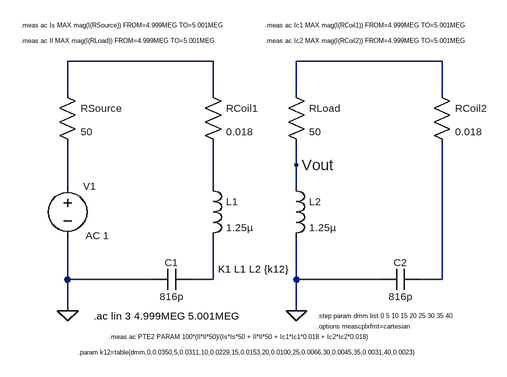
[diagram p0: schematic 2-coil_resonant_part-C.asc]
2-coil_resonant_part-C.asc, the LTspice schematic file:
Version 4.1
SHEET 1 880 680
WIRE 192 80 -32 80
WIRE 544 80 320 80
WIRE -32 128 -32 80
WIRE 192 128 192 80
WIRE 320 128 320 80
WIRE 544 128 544 80
WIRE 320 240 320 208
WIRE -32 272 -32 208
WIRE 192 272 192 208
WIRE 320 272 320 240
WIRE -32 416 -32 352
WIRE 96 416 -32 416
WIRE 192 416 192 352
WIRE 192 416 160 416
WIRE 320 416 320 352
WIRE 448 416 320 416
WIRE 544 416 544 208
WIRE 544 416 512 416
WIRE -32 464 -32 416
WIRE 320 464 320 416
FLAG -32 464 0
FLAG 320 464 0
FLAG 320 240 Vout
SYMBOL res -48 112 R0
WINDOW 0 36 40 Left 1
WINDOW 3 36 76 Left 1
SYMATTR InstName RSource
SYMATTR Value 50
SYMBOL res 304 112 R0
WINDOW 0 36 40 Left 1
WINDOW 3 36 76 Left 1
SYMATTR InstName RLoad
SYMATTR Value 50
SYMBOL ind 176 256 R0
WINDOW 0 36 40 Left 1
WINDOW 3 36 80 Left 1
SYMATTR InstName L1
SYMATTR Value 1.25µ
SYMATTR Type ind
SYMATTR SpiceLine Rser=1m
SYMBOL ind 304 256 R0
WINDOW 0 36 40 Left 1
WINDOW 3 36 80 Left 1
SYMATTR InstName L2
SYMATTR Value 1.25µ
SYMATTR Type ind
SYMATTR SpiceLine Rser=1m
SYMBOL voltage -32 256 R0
WINDOW 123 28 92 Left 1
WINDOW 39 0 0 Left 0
WINDOW 0 24 16 Left 1
SYMATTR Value2 AC 1
SYMATTR InstName V1
SYMATTR Value ""
SYMBOL cap 160 400 R90
WINDOW 0 0 32 VBottom 1
WINDOW 3 32 32 VTop 1
SYMATTR InstName C1
SYMATTR Value 816p
SYMBOL cap 512 400 R90
WINDOW 0 0 32 VBottom 1
WINDOW 3 32 32 VTop 1
SYMATTR InstName C2
SYMATTR Value 816p
SYMBOL res 176 112 R0
WINDOW 0 36 40 Left 1
WINDOW 3 36 76 Left 1
SYMATTR InstName RCoil1
SYMATTR Value 0.018
SYMBOL res 528 112 R0
WINDOW 0 36 40 Left 1
WINDOW 3 36 76 Left 1
SYMATTR InstName RCoil2
SYMATTR Value 0.018
TEXT 200 400 Left 1 !K1 L1 L2 {k12}
TEXT 352 472 Left 0 !.step param dmm list 0 5 10 15 20 25 30 35 40
TEXT -16 528 Left 0 !.param k12=table(dmm,0,0.0350,5,0.0311,10,0.0229,15,0.0153,20,0.0100,25,0.0066,30,0.0045,35,0.0031,40,0.0023)
TEXT -104 24 Left 0 !.meas ac Is MAX mag(I(RSource)) FROM=4.999MEG TO=5.001MEG
TEXT -104 48 Left 0 !.meas ac Il MAX mag(I(RLoad)) FROM=4.999MEG TO=5.001MEG
TEXT 272 24 Left 0 !.meas ac Ic1 MAX mag(I(RCoil1)) FROM=4.999MEG TO=5.001MEG
TEXT 272 48 Left 0 !.meas ac Ic2 MAX mag(I(RCoil2)) FROM=4.999MEG TO=5.001MEG
TEXT 32 504 Left 0 !.meas ac PTE2 PARAM 100*(Il*Il*50)/(Is*Is*50 + Il*Il*50 + Ic1*Ic1*0.018 + Ic2*Ic2*0.018)
TEXT 8 472 Left 1 !.ac lin 3 4.999MEG 5.001MEG
TEXT 352 488 Left 0 !.options meascplxfmt=cartesian

The netlist it stands for:
* 2-coil_resonant_part-C.asc
RSource N001 N003 50
RLoad N002 Vout 50
L1 N004 N005 1.25µ Rser=1m
L2 Vout 0 1.25µ Rser=1m
V1 N003 0 AC 1
C1 N005 0 816p
C2 N006 0 816p
RCoil1 N001 N004 0.018
RCoil2 N002 N006 0.018
K1 L1 L2 {k12}
.step param dmm list 0 5 10 15 20 25 30 35 40
.param k12=table(dmm,0,0.0350,5,0.0311,10,0.0229,15,0.0153,20,0.0100,25,0.0066,30,0.0045,35,0.0031,40,0.0023)
.meas ac Is MAX mag(I(RSource)) FROM=4.999MEG TO=5.001MEG
.meas ac Il MAX mag(I(RLoad)) FROM=4.999MEG TO=5.001MEG
.meas ac Ic1 MAX mag(I(RCoil1)) FROM=4.999MEG TO=5.001MEG
.meas ac Ic2 MAX mag(I(RCoil2)) FROM=4.999MEG TO=5.001MEG
.meas ac PTE2 PARAM 100*(Il*Il*50)/(Is*Is*50 + Il*Il*50 + Ic1*Ic1*0.018 + Ic2*Ic2*0.018)
.ac lin 3 4.999MEG 5.001MEG
.options meascplxfmt=cartesian
.backanno
.end